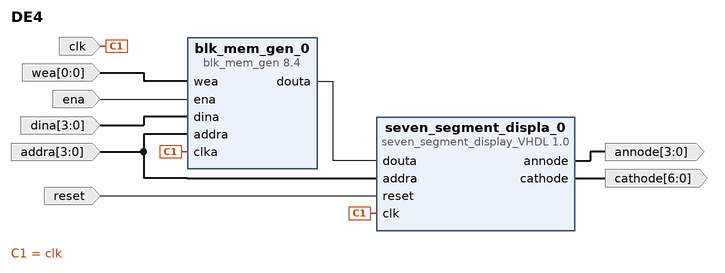
[diagram p0: block diagram of the top level]
# Vivado block design DE4, xc7a35tcpg236-1, Vivado 2019.2
create_bd_design DE4

create_bd_port -dir O -from 6 -to 0 cathode
create_bd_port -dir O -from 3 -to 0 annode
create_bd_port -dir I reset
create_bd_port -dir I -from 3 -to 0 addra
create_bd_port -dir I -from 3 -to 0 dina
create_bd_port -dir I ena
create_bd_port -dir I -from 0 -to 0 wea
create_bd_port -dir I clk

create_bd_cell -type ip -vlnv xilinx.com:ip:blk_mem_gen:8.4 blk_mem_gen_0
set_property -dict [list \
  CONFIG.Algorithm Minimum_Area \
  CONFIG.Coe_File ../../../../../../IPBRAM.coe \
  CONFIG.Enable_32bit_Address false \
  CONFIG.Enable_A Use_ENA_Pin \
  CONFIG.Fill_Remaining_Memory_Locations false \
  CONFIG.Load_Init_File true \
  CONFIG.Operating_Mode_A WRITE_FIRST \
  CONFIG.Read_Width_A 4 \
  CONFIG.Register_PortA_Output_of_Memory_Primitives true \
  CONFIG.Use_Byte_Write_Enable false \
  CONFIG.Use_RSTA_Pin false \
  CONFIG.Write_Depth_A 16 \
  CONFIG.Write_Width_A 4 \
  CONFIG.use_bram_block Stand_Alone \
] [get_bd_cells blk_mem_gen_0]
create_bd_cell -type ip -vlnv xilinx.com:user:seven_segment_display_VHDL:1.0 seven_segment_displa_0

# ---- connections ----

connect_bd_net [get_bd_pins seven_segment_displa_0/cathode] [get_bd_ports cathode]
connect_bd_net [get_bd_pins seven_segment_displa_0/annode] [get_bd_ports annode]
connect_bd_net [get_bd_ports wea] [get_bd_pins blk_mem_gen_0/wea]
connect_bd_net [get_bd_ports ena] [get_bd_pins blk_mem_gen_0/ena]
connect_bd_net [get_bd_pins blk_mem_gen_0/douta] [get_bd_pins seven_segment_displa_0/douta]
connect_bd_net [get_bd_ports dina] [get_bd_pins blk_mem_gen_0/dina]
connect_bd_net [get_bd_ports addra] [get_bd_pins blk_mem_gen_0/addra] [get_bd_pins seven_segment_displa_0/addra]
connect_bd_net [get_bd_ports clk] [get_bd_pins blk_mem_gen_0/clka] [get_bd_pins seven_segment_displa_0/clk]
connect_bd_net [get_bd_ports reset] [get_bd_pins seven_segment_displa_0/reset]

validate_bd_design
save_bd_design
